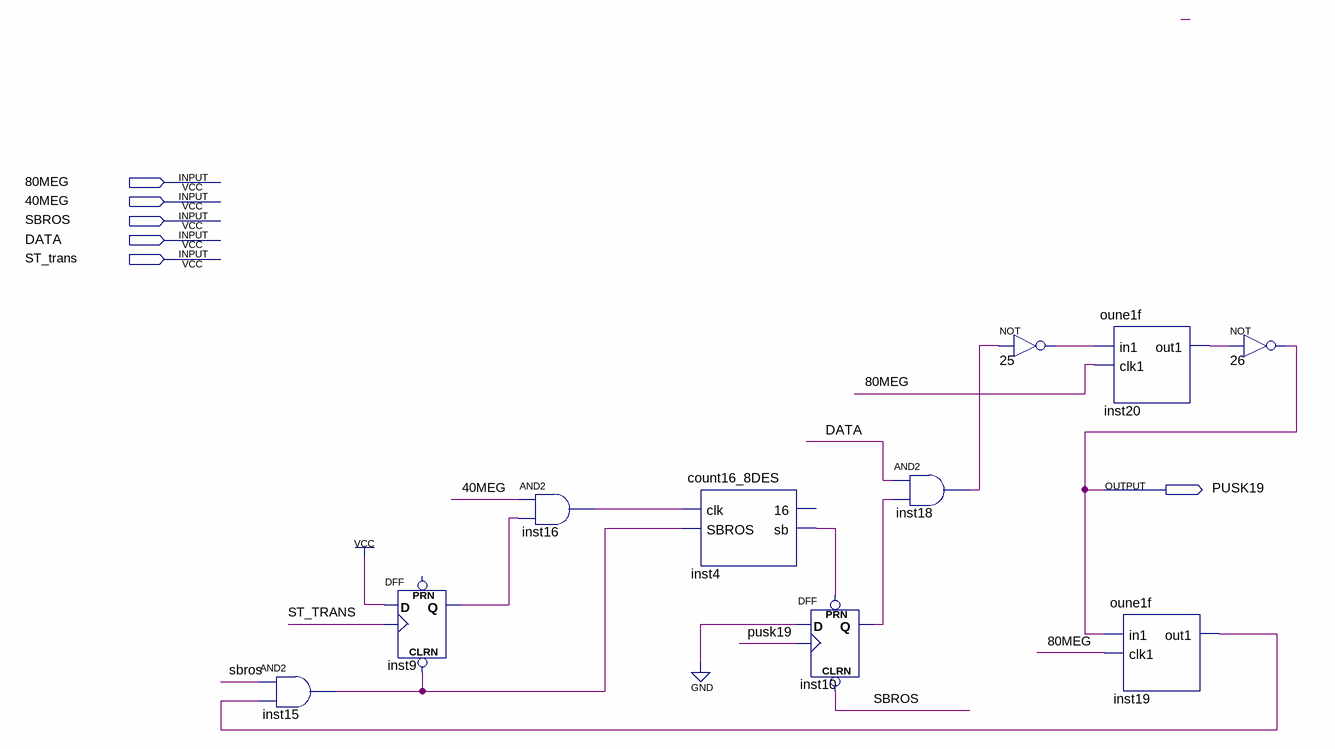
[diagram p0: schematic sheet]
// Quartus schematic BLOK_START.bdf as structural Verilog: 10 symbols, 6 pins
module BLOK_START (
  input  \80MEG ,
  input  \40MEG ,
  input  SBROS,
  input  DATA,
  input  ST_trans,
  output PUSK19
);

  wire inst4_sb, inst9_q, inst10_q, inst15_out, inst16_out, inst18_out, inst19_out1, inst20_out1, n25_out;

  and inst15 (inst15_out, SBROS, inst19_out1);
  DFF inst9 (.CLRN(inst15_out), .CLK(ST_trans), .D(1'b1), .Q(inst9_q));  // open: PRN
  and inst16 (inst16_out, \40MEG , inst9_q);
  count16_8DES inst4 (.clk(inst16_out), .SBROS(inst15_out), .sb(inst4_sb));  // open: 16
  DFF inst10 (.CLRN(SBROS), .CLK(PUSK19), .D(1'b0), .PRN(inst4_sb), .Q(inst10_q));
  and inst18 (inst18_out, DATA, inst10_q);
  not u_25 (n25_out, inst18_out);
  oune1f inst20 (.in1(n25_out), .clk1(\80MEG ), .out1(inst20_out1));
  oune1f inst19 (.in1(PUSK19), .clk1(\80MEG ), .out1(inst19_out1));
  not u_26 (PUSK19, inst20_out1);
endmodule
